# Altium project Base_Board.PrjPcb
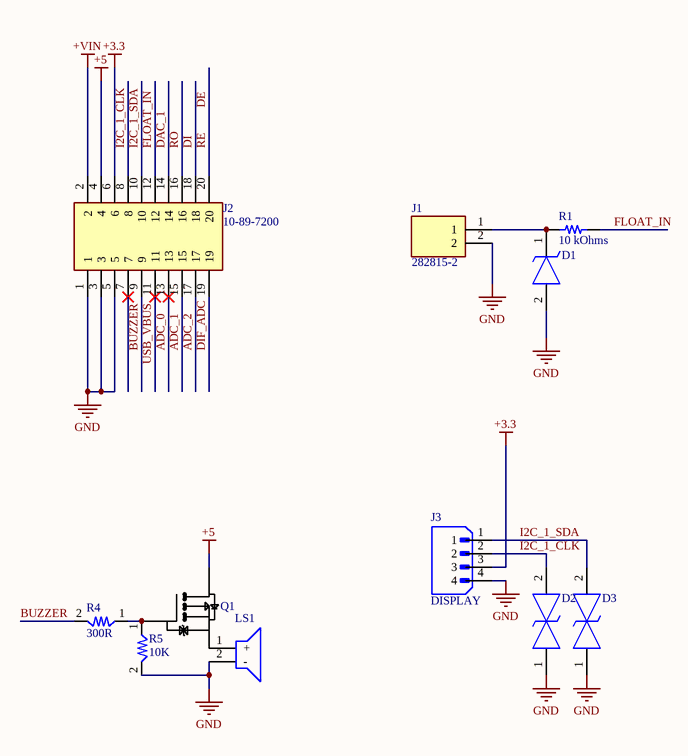
[diagram p0: Pinout.SchDoc]
5 sheets, 73 parts. Net scope: global (net labels, ports and power ports of the same name join across sheets).
Board file: PCB.PcbDoc
Sheets:
  Pinout.SchDoc
  PWR.SchDoc
  RS485.SchDoc
  ADC.SchDoc
  DAC_OUT.SchDoc

## Sheet Pinout.SchDoc
size A; SheetNumber: 1; SheetTotal: 5

### Parts
D1  SMBJ5.0A  [SMBJ12A]  (value not drawn)
D2  DESD3V3Z1BCSF-7  [DESD3V3Z1BCSF7]  (value not drawn)
D3  DESD3V3Z1BCSF-7  [DESD3V3Z1BCSF7]  (value not drawn)
J1  282815-2  [SHDRRA2W102P0X508_1X2_1016X1200X850P]
J2  10-89-7200  [HDRV20W87P254_2X10_2553X508X864P]
J3  DISPLAY  [JST_B4B-XH-A(LF)(SN)]
LS1  CMI-1295IC-0585T  [CMI1295IC0585T]  (value not drawn)
Q1  DMG3415U-7  [SOT96P240X110-3N]  (value not drawn)
R1  10 kOhms  [RES 0603_1608]
R4  300R  [RES0603]
R5  10K  [RES0603]

### Nets
+3.3: J2.6 J3.3
+5: J2.4 Q1.3(D)
+VIN: J2.2
GND: D1.2(A) D2.1 D3.1 J1.2 J2.1 J2.3 J2.5 J3.4 LS1.2(-) R5.2
ADC_0: J2.13
ADC_1: J2.15
ADC_2: J2.17
BUZZER: J2.9 R4.2
DAC_1: J2.14
DE: J2.20  [also labelled RE]
DI: J2.18
DIF_ADC: J2.19
FLOAT_IN: J2.12 R1.1
I2C_1_CLK: D2.2 J2.8 J3.2
I2C_1_SDA: D3.2 J2.10 J3.1
RO: J2.16
USB_VBUS: J2.11
NetD1_1: D1.1(K) J1.1 R1.2
NetLS1_1: LS1.1(+) Q1.2(S)
NetQ1_1: Q1.1(G) R4.1 R5.1

Not connected (* = marked no-connect by the designer): J2 7*

### Library data of the parts
D1 = SMBJ5.0A: TVS Diode (Uni-directional); Manufacturer_Name: STMicroelectronics; Datasheet Link: https://www.st.com/resource/en/datasheet/smbj12a.pdf; Height: 2.45mm; Manufacturer_Part_Number: SMBJ5.0A
D2 D3 = DESD3V3Z1BCSF-7: TVS Diode (Bi-directional); Manufacturer_Name: Diodes Incorporated; Datasheet Link: https://www.diodes.com/assets/Package-Files/X2-WLB0603-2.pdf; Height: 0.32mm; Manufacturer_Part_Number: DESD3V3Z1BCSF-7; Mouser Part Number: 621-DESD3V3Z1BCSF-7; Mouser Price/Stock: https://www.mouser.co.uk/ProductDetail/Diodes-Incorporated/DESD3V3Z1BCSF-7?qs=HXFqYaX1Q2xS5VnKZuyjmg%3D%3D; Arrow Part Number: DESD3V3Z1BCSF-7; Arrow Price/Stock: https://www.arrow.com/en/products/desd3v3z1bcsf-7/diodes-incorporated?utm_currency=USD&region=nac
J1 = 282815-2: Connector; Manufacturer_Name: TE Connectivity; Datasheet Link: https://www.te.com/commerce/DocumentDelivery/DDEController?Action=srchrtrv&DocNm=1-773958-1&DocType=Data%20Sheet&DocLang=English&PartCntxt=282815-2&DocFormat=pdf; Height: 8.5mm; Manufacturer_Part_Number: 282815-2; Mouser Part Number: 571-282815-2; Mouser Price/Stock: https://www.mouser.co.uk/ProductDetail/TE-Connectivity/282815-2?qs=79%2FjLZ2kXkpF7MFURi982A%3D%3D; Arrow Part Number: 282815-2; Arrow Price/Stock: https://www.arrow.com/en/products/282815-2/te-connectivity?region=nac
J2 = 10-89-7200: Connector; Manufacturer_Name: Molex; Datasheet Link: https://www.molex.com/content/dam/molex/molex-dot-com/products/automated/en-us/salesdrawingpdf/702/70280/010897200_sd.pdf?inline; Height: 8.64mm; Manufacturer_Part_Number: 10-89-7200; Mouser Part Number: 538-10-89-7200; Mouser Price/Stock: https://www.mouser.co.uk/ProductDetail/Molex/10-89-7200?qs=oWQp3ZoCHH25CPUgqQXm8A%3D%3D
J3 = B4B-XH-A(LF)(SN): Connector Header Through Hole 4 position 0.098 (2.50mm); MF: JST Sales; SnapEDA_Link: https://www.snapeda.com/parts/B4B-XH-A(LF)(SN)/JST+Sales+America+Inc./view-part/?ref=snap; Package: None; Value: *; MP: B4B-XH-A(LF)(SN); Check_prices: https://www.snapeda.com/parts/B4B-XH-A(LF)(SN)/JST+Sales+America+Inc./view-part/?ref=eda
LS1 = CMI-1295IC-0585T: Loudspeaker or Buzzer; Manufacturer_Name: Same Sky; Datasheet Link: https://www.sameskydevices.com/product/resource/CMI-1295IC-0585T.pdf; Height: 9.7mm; Manufacturer_Part_Number: CMI-1295IC-0585T; Mouser Part Number: 490-CMI-1295IC-0585T; Mouser Price/Stock: https://www.mouser.co.uk/ProductDetail/Same-Sky/CMI-1295IC-0585T?qs=OlC7AqGiEDkuskN%2Fok3iNw%3D%3D; Arrow Part Number: CMI-1295IC-0585T; Arrow Price/Stock: https://www.arrow.com/en/products/cmi-1295ic-0585t/cui-devices?utm_currency=USD&region=nac
Q1 = DMG3415U-7: Integrated Circuit; Manufacturer_Name: Lattice Semiconductor; Datasheet Link: https://media.digikey.com/pdf/Data%20Sheets/Diodes%20PDFs/DMG3415U.pdf; Height: 1.1mm; Manufacturer_Part_Number: DMG3415U-7; Mouser Part Number: N/A; Mouser Price/Stock: https://www.mouser.com/Search/Refine.aspx?Keyword=N%2FA
R1 = RT0603FRE0710KL: RES SMD 10K OHM 1% 1/10W 0603; Manufacturer: Yageo; Power (Watts): 0.1W, 1/10W; Temperature Coefficient: ±50ppm/°C; Part Number: RT0603FRE0710KL; Value: 10 kOhms; ComponentLink1Description: Datasheet; ComponentLink1URL: https://www.yageo.com/upload/media/product/productsearch/datasheet/rchip/PYu-RT_1-to-0.01_RoHS_L_11.pdf; ComponentLink2Description: DigiKey Link; ComponentLink2URL: https://www.digikey.com/en/products/detail/yageo/RT0603FRE0710KL/1075040; Composition: Thin Film; Device Package: 0603 (1608 Metric); Height - Seated (Max): 0.022" (0.55mm); LastUpdated: 9/19/2022 1:22:31 PM; Lifecycle Status: Active; Minimum Order: 1; Number of Terminations: 2; Operating Temperature: -55°C ~ 155°C; Package / Case: 0603 (1608 Metric); Packaging: TapeAndReel; PartId: 5671; Part Status: Active; Price: 0.01; Resistance: 10 kOhms; Series: RT; Size / Dimension: 0.063" L x 0.031" W (1.60mm x 0.80mm); Supplier 1: DigiKey; Supplier Part Number 1: YAG2321CT-ND; Supplier Device Package: 0603; Tolerance: ±1%
R4 R5 = RES: Resistor; Manufacturer_Name: UNI-ROYAL(Uniroyal Elec); Manufacturer_Part_Number: 0603WAF1001T5E; Datasheet Link: https://datasheet.lcsc.com/szlcsc/Uniroyal-Elec-0603WAF1001T5E_C21190.pdf; Height: 0.55mm

## Sheet PWR.SchDoc
size A; SheetNumber: 1; SheetTotal: 4
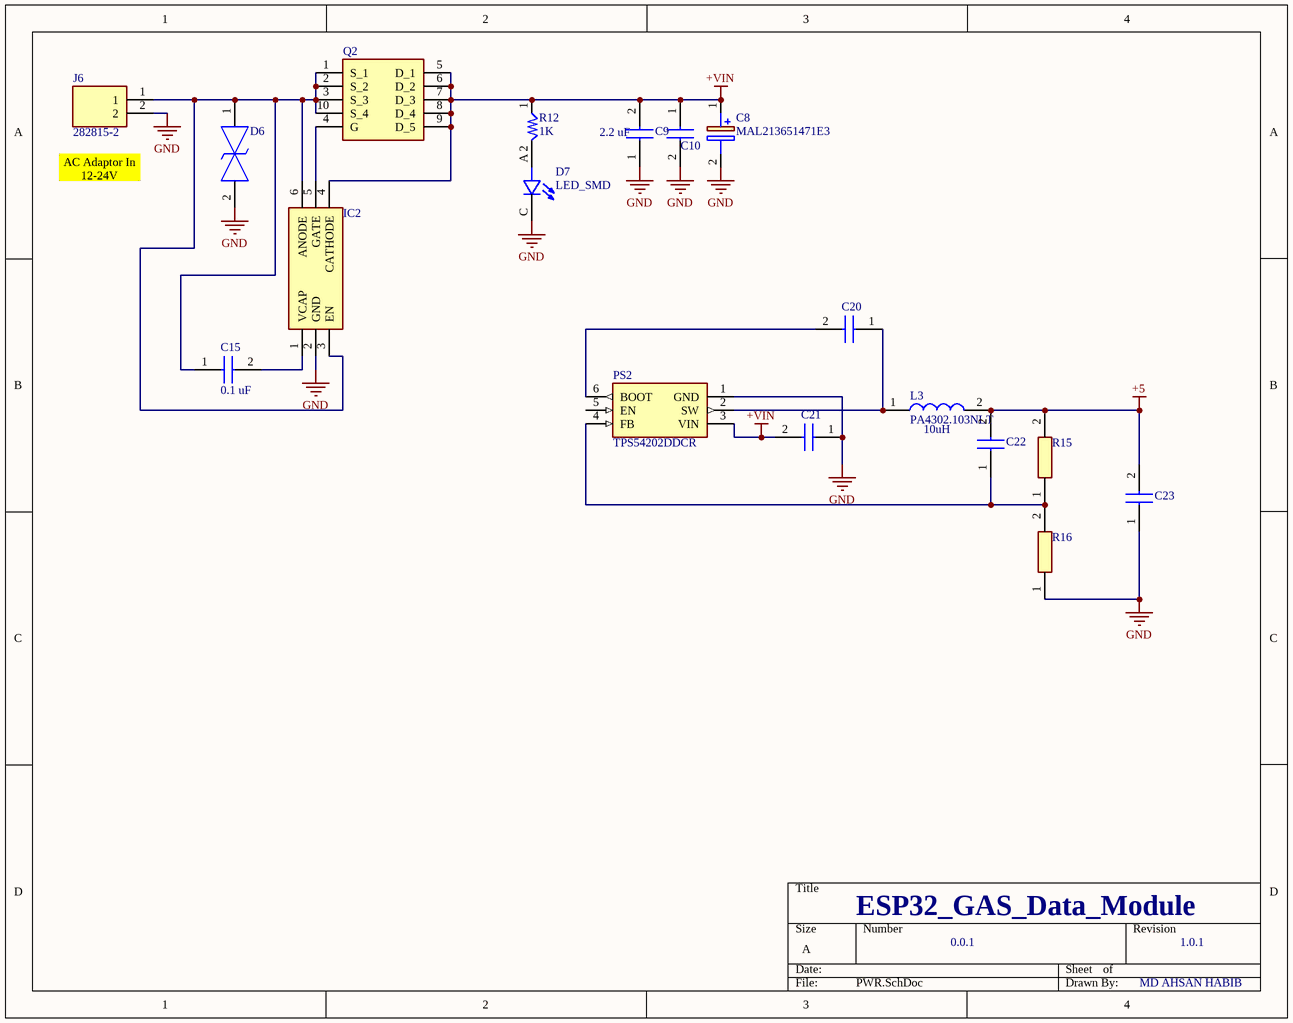
[diagram p1: PWR.SchDoc]

### Parts
C8  MAL213651471E3  [CAPPRD500W60D1300H2700]
C9  2.2 uF  [CAP0603]
C10  C5750X5R1H106K230KA  [C5750_Commercial]  (value not drawn)
C15  0.1 uF  [CAP0603]
C20  C0805C104M5RAC-TU  [CAPC2012X88N]  (value not drawn)
C21  C5750X5R1H106K230KA  [CAP0603]  (value not drawn)
C22  CGA1A2C0G1E820J030BA  [CAP0603]  (value not drawn)
C23  GRM32ER61C476KE15L  [CAPC3225X270N]  (value not drawn)
D6  SMBJ24CA-13-F  [DIONM5336X250N]  (value not drawn)
D7  LED_SMD  [LEDSC125X200X90-2N]
IC2  LM74700QDBVTQ1  [SOT95P280X145-6N]  (value not drawn)
J6  282815-2  [SHDRRA2W102P0X508_1X2_1016X1200X850P]
L3  PA4302.103NLT  [PA4302103NLT]
PS2  TPS54202DDCR  [SOT95P280X110-6N]
Q2  BSC014N06NSATMA1  [BSC010N04LS6ATMA1]  (value not drawn)
R12  1K  [RES0603]
R15  CRCW0402100KFKEDHP  [RES0603]  (value not drawn)
R16  CRCW040213K7FKEDHP  [RES0603]  (value not drawn)

### Nets
+5: C22.2 C23.2 L3.2 R15.2
+VIN: C8.1(+) C9.2 C10.1 C21.2 IC2.4(CATHODE) PS2.3(VIN) Q2.5(D_1) Q2.6(D_2) Q2.7(D_3) Q2.8(D_4) Q2.9(D_5) R12.1
GND: C8.2(-) C9.1 C10.2 C21.1 C23.1 D6.2 D7.C IC2.2(GND) J6.2 PS2.1(GND) R16.1
NetC15_1: C15.1 D6.1 IC2.3(EN) IC2.6(ANODE) J6.1 Q2.1(S_1) Q2.2(S_2) Q2.3(S_3) Q2.10(S_4)
NetC15_2: C15.2 IC2.1(VCAP)
NetC20_1: C20.1 L3.1 PS2.2(SW)
NetC20_2: C20.2 PS2.6(BOOT)
NetC22_1: C22.1 PS2.4(FB) R15.1 R16.2
NetD7_A: D7.A R12.2
NetIC2_5: IC2.5(GATE) Q2.4(G)

Not connected (* = marked no-connect by the designer): PS2 5(EN)

### Notes on the sheet
- (near J6) AC Adaptor In 12-24V
- (near L3) 10uH
- ESP32_GAS_Data_Module
- 0.0.1
- 1.0.1
- MD AHSAN HABIB

### Library data of the parts
C8 = MAL213651471E3: Capacitor Polarised; Manufacturer_Name: Vishay; Datasheet Link: https://www.mouser.co.uk/datasheet/2/427/136rvi-1762300.pdf; Height: 27mm; Manufacturer_Part_Number: MAL213651471E3; Mouser Part Number: 594-2222-136-51471; Mouser Price/Stock: https://www.mouser.co.uk/ProductDetail/Vishay-BC-Components/MAL213651471E3?qs=zGH8QOQ14qXx9%252BWDTpPwWA%3D%3D
C9 C15 = CC0603KRX7R9BB104: Capacitor; Manufacturer_Name: YAGEO; Datasheet Link: https://componentsearchengine.com/Datasheets/2/CC0603KRX7R9BB104.pdf; Height: 0.9mm; Manufacturer_Part_Number: CC0603KRX7R9BB104; Mouser Part Number: 603-CC603KRX7R9BB104; Mouser Price/Stock: https://www.mouser.co.uk/ProductDetail/YAGEO/CC0603KRX7R9BB104?qs=vTakOoo5QyLvVCYM2ge8LQ%3D%3D; Arrow Part Number: CC0603KRX7R9BB104; Arrow Price/Stock: https://www.arrow.com/en/products/cc0603krx7r9bb104/yageo?utm_currency=USD&region=europe
C10 C21 = C5750X5R1H106K230KA: Capacitor; Manufacturer_Name: TDK; Datasheet Link: https://product.tdk.com/system/files/dam/doc/product/capacitor/ceramic/mlcc/catalog/mlcc_commercial_general_en.pdf; Height: 2.5mm; Manufacturer_Part_Number: C5750X5R1H106K230KA; Mouser Part Number: 810-C5750X5R1H106K; Mouser Price/Stock: https://www.mouser.co.uk/ProductDetail/TDK/C5750X5R1H106K230KA?qs=NRhsANhppD8lVYAvl0MZ3g%3D%3D; Arrow Part Number: C5750X5R1H106K230KA; Arrow Price/Stock: https://www.arrow.com/en/products/c5750x5r1h106k230ka/tdk?region=nac
C20 = C0805C104M5RAC-TU: Capacitor; Manufacturer_Name: Yageo Group; Datasheet Link: https://connect.kemet.com:7667/gateway/IntelliData-ComponentDocumentation/1.0/download/specsheet/C0805C104M5RACTU; Height: 0.88mm; Manufacturer_Part_Number: C0805C104M5RAC-TU; Arrow Part Number: C0805C104M5RAC-TU; Arrow Price/Stock: https://www.arrow.com/en/products/c0805c104m5ractu/kemet-corporation?region=nac
C22 = CGA1A2C0G1E820J030BA: Capacitor; Manufacturer_Name: TDK; Datasheet Link: https://product.tdk.com/system/files/dam/doc/product/capacitor/ceramic/mlcc/catalog/mlcc_automotive_general_en.pdf; Height: 0.33mm; Manufacturer_Part_Number: CGA1A2C0G1E820J030BA
C23 = GRM32ER61C476KE15L: Capacitor; Manufacturer_Name: Murata Electronics; Datasheet Link: https://search.murata.co.jp/Ceramy/image/img/A01X/G101/ENG/GRM32ER61C476KE15-01A.pdf; Height: 2.7mm; Manufacturer_Part_Number: GRM32ER61C476KE15L; Mouser Part Number: 81-GRM32ER61C476KE5L; Mouser Price/Stock: https://www.mouser.co.uk/ProductDetail/Murata-Electronics/GRM32ER61C476KE15L?qs=%252B%2F7tQhzlcy7Im%2F1Gh2YSGQ%3D%3D; Arrow Part Number: GRM32ER61C476KE15L; Arrow Price/Stock: https://www.arrow.com/en/products/grm32er61c476ke15l/murata-manufacturing?utm_currency=USD&region=europe
D6 = SMBJ24CA-13-F: TVS Diode (Bi-directional); Manufacturer_Name: Diodes Incorporated; Datasheet Link: https://www.diodes.com/assets/Datasheets/ds19002.pdf; Height: 2.5mm; Manufacturer_Part_Number: SMBJ24CA-13-F; Mouser Part Number: 621-SMBJ24CA-13-F; Mouser Price/Stock: https://www.mouser.co.uk/ProductDetail/Diodes-Incorporated/SMBJ24CA-13-F?qs=gaDBXWSqsDCkhBi9r6ReOQ%3D%3D; Arrow Part Number: SMBJ24CA-13-F; Arrow Price/Stock: https://www.arrow.com/en/products/smbj24ca-13-f/diodes-incorporated?utm_currency=USD&region=nac
D7 = 5990110007F: Red 633nm LED Indication - Discrete 2.1V 0805 (2012 Metric); MF: Dialight; MP: 599-0110-007F; Check_prices: https://www.snapeda.com/parts/599-0110-007F/Dialight/view-part/?ref=eda; Value: *; Purchase-URL: https://pricing.snapeda.com/search/part/599-0110-007F/?ref=eda; Price: None; SnapEDA_Link: https://www.snapeda.com/parts/599-0110-007F/Dialight/view-part/?ref=snap; Availability: In Stock; Package: 0805 Dialight
IC2 = LM74700-Q1MKX-1_NOPB: Integrated Circuit; Manufacturer_Name: Texas Instruments; Manufacturer_Part_Number: LM74700-Q1MKX-1/NOPB; Datasheet Link: http://www.ti.com/lit/ds/symlink/lm74700-q1.pdf; Height: 1.45mm
J6 = 282815-2: as J1 on sheet Pinout; Datasheet Link: https://www.te.com/commerce/DocumentDelivery/DDEController?Action=srchrtrv&DocNm=1-773958-1&DocType=Data%20Sheet&DocLang=English&PartCntxt=282815-2&DocFormat=pdf; Height: 8.5mm; Manufacturer_Part_Number: 282815-2; Mouser Part Number: 571-282815-2; Mouser Price/Stock: https://www.mouser.co.uk/ProductDetail/TE-Connectivity/282815-2?qs=79%2FjLZ2kXkpF7MFURi982A%3D%3D; Arrow Part Number: 282815-2; Arrow Price/Stock: https://www.arrow.com/en/products/282815-2/te-connectivity?region=nac
L3 = PA4302.103NLT: Inductor; Manufacturer_Name: Yageo Group; Datasheet Link: https://www.mouser.com/datasheet/2/336/-559356.pdf; Height: 5.6mm; Manufacturer_Part_Number: PA4302.103NLT; Mouser Part Number: 673-PA4302.103NLT; Mouser Price/Stock: https://www.mouser.co.uk/ProductDetail/Pulse-Electronics/PA4302.103NLT?qs=ZU1dyKYMvyPXoPwo6qMOJg%3D%3D; Arrow Part Number: PA4302.103NLT; Arrow Price/Stock: https://www.arrow.com/en/products/pa4302.103nlt/pulse-electronics-corporation?region=nac
PS2 = TPS54202DDCR: Power Supply; Manufacturer_Name: Texas Instruments; Datasheet Link: http://www.ti.com/lit/gpn/tps54202; Height: 1.1mm; Manufacturer_Part_Number: TPS54202DDCR; Mouser Part Number: 595-TPS54202DDCR; Mouser Price/Stock: https://www.mouser.co.uk/ProductDetail/Texas-Instruments/TPS54202DDCR?qs=uP22XH7NdCsJtN%2Fq54jCtQ%3D%3D; Arrow Part Number: TPS54202DDCR; Arrow Price/Stock: https://www.arrow.com/en/products/tps54202ddcr/texas-instruments?utm_currency=USD&region=nac
Q2 = BSC014N06NSATMA1: MOSFET (N-Channel); Manufacturer_Name: Infineon; Datasheet Link: http://www.farnell.com/datasheets/1849651.html; Height: 1.1mm; Manufacturer_Part_Number: BSC014N06NSATMA1; Mouser Part Number: 726-BSC014N06NSATMA1; Mouser Price/Stock: https://www.mouser.co.uk/ProductDetail/Infineon-Technologies/BSC014N06NSATMA1?qs=K00xGehIljshgUA78G26tg%3D%3D; Arrow Part Number: BSC014N06NSATMA1; Arrow Price/Stock: https://www.arrow.com/en/products/bsc014n06nsatma1/infineon-technologies-ag?region=nac
R12 = RES: as R4 on sheet Pinout; Datasheet Link: https://datasheet.lcsc.com/szlcsc/Uniroyal-Elec-0603WAF1001T5E_C21190.pdf; Height: 0.55mm
R15 = CRCW0402100KFKEDHP: Resistor; Manufacturer_Name: Vishay; Datasheet Link: http://www.vishay.com/docs/20035/dcrcwe3.pdf; Height: 0.4mm; Manufacturer_Part_Number: CRCW0402100KFKEDHP; Mouser Part Number: 71-CRCW0402100KFKEDH; Mouser Price/Stock: https://www.mouser.co.uk/ProductDetail/Vishay-Dale/CRCW0402100KFKEDHP?qs=k2%2FDWSARqgGFakjlJe4Ejw%3D%3D; Arrow Part Number: CRCW0402100KFKEDHP; Arrow Price/Stock: https://www.arrow.com/en/products/crcw0402100kfkedhp/vishay?utm_currency=USD&region=nac
R16 = CRCW040213K7FKEDHP: Resistor; Manufacturer_Name: Vishay; Datasheet Link: http://www.vishay.com/docs/20035/dcrcwe3.pdf; Height: 0.4mm; Manufacturer_Part_Number: CRCW040213K7FKEDHP; Mouser Part Number: N/A; Mouser Price/Stock: https://www.mouser.co.uk/ProductDetail/Vishay-Dale/CRCW040213K7FKEDHP?qs=VAB4DzKv5wWcbGmoe9QIoA%3D%3D; Arrow Part Number: CRCW040213K7FKEDHP; Arrow Price/Stock: https://www.arrow.com/en/products/crcw040213k7fkedhp/vishay?region=nac

## Sheet RS485.SchDoc
size A; SheetNumber: 3; SheetTotal: 4
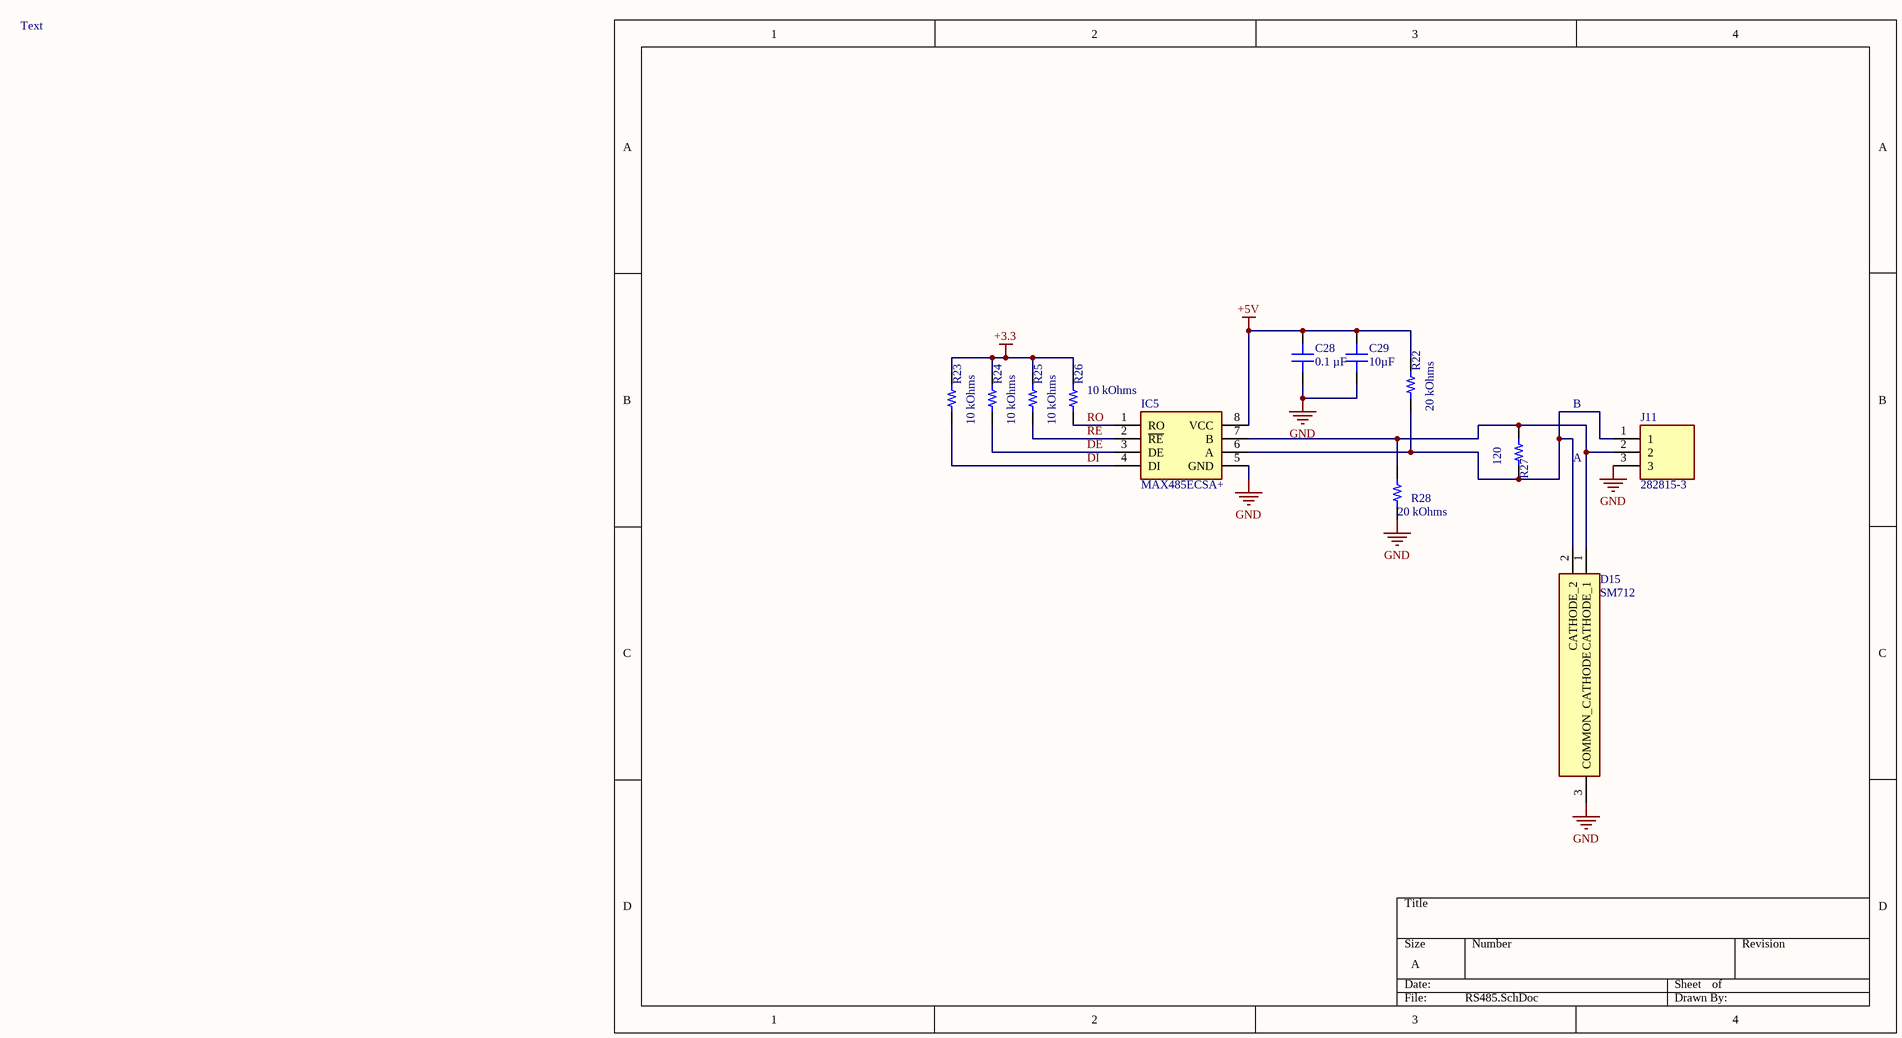
[diagram p2: RS485.SchDoc]

### Parts
C28  0.1 µF  [CAP 0603_1608]
C29  10µF  [CAP 1206_3216 - 1.8MM]
D15  SM712  [SOT95P240X115-3N]
IC5  MAX485ECSA+  [SOIC127P600X175-8N]
J11  282815-3  [2828153]
R22  20 kOhms  [RES 0603_1608]
R23  10 kOhms  [RES 0603_1608]
R24  10 kOhms  [RES 0603_1608]
R25  10 kOhms  [RES 0603_1608]
R26  10 kOhms  [RES 0603_1608]
R27  120  [RES 0603_1608]
R28  20 kOhms  [RES 0603_1608]

### Nets
+3.3: R23.2 R24.2 R25.2 R26.2
+5V: C28.2 C29.2 IC5.8(VCC) R22.2
GND: C28.1 C29.1 D15.3(COMMON_CATHODE) IC5.5(GND) J11.3 R28.1
DE: IC5.2(~{RE}) IC5.3(DE) R24.1 R25.1  [also labelled RE]
DI: IC5.4(DI) R23.1
RO: IC5.1(RO) R26.1
NetD15_1: D15.1(CATHODE_1) IC5.7(B) J11.2 R27.2 R28.2
NetD15_2: D15.2(CATHODE_2) IC5.6(A) J11.1 R22.1 R27.1

### Notes on the sheet
- Text
- B
- A

### Library data of the parts
C28 = C0603C104K5RAC7411: CAP CER 0.1UF 50V X7R 0603; manufacturer: KEMET; Tolerance: ±10%; Part Number: C0603C104K5RAC7411; Value: 0.1 µF; Applications: Bypass, Decoupling; Capacitance: 0.1 µF; componentlink1description: Datasheet; componentlink1url: https://api.kemet.com/component-edge/download/datasheet/C0603C104K5RAC7411.pdf; componentlink2description: DigiKey Link; componentlink2url: https://www.digikey.com/en/products/detail/kemet/C0603C104K5RAC7411/3317013; Device Package: 0603 (1608 Metric); lastupdated: 9/19/2022 1:01:20 PM; Lifecycle Status: Active; Minimum Order: 15000; Mounting Type: Surface Mount, MLCC; Operating Temperature: -55°C ~ 125°C; Package / Case: 0603 (1608 Metric); packaging: TapeAndReel; partid: 2233; Part Status: Active; price: 0.01; series: SMD Comm X7R; Size / Dimension: 0.063" L x 0.031" W (1.60mm x 0.80mm); Supplier 1: DigiKey; Supplier Part Number 1: 399-7374-2-ND; Temperature Coefficient: X7R; Thickness (Max): 0.035" (0.90mm); Voltage - Rated: 50V
C29 = 12065D106KAT2A: CAP CER 10UF 50V X5R 1206; manufacturer: AVX Corporation; Tolerance: ±10%; Part Number: 12065D106KAT2A; Value: 10µF; Applications: General Purpose; Capacitance: 10µF; componentlink1description: Datasheet; componentlink1url: http://datasheets.avx.com/cx5r.pdf; componentlink2description: DigiKey Link; componentlink2url: http://digikey.com/product-detail/en/avx-corporation/12065D106KAT2A/478-9979-1-ND/6149060; Device Package: 1206 (3216 Metric); lastupdated: 9/2/2020 1:05:35 AM; Lifecycle Status: Active; Minimum Order: 1; Mounting Type: Surface Mount, MLCC; Operating Temperature: -55°C ~ 85°C; Package / Case: 1206 (3216 Metric); packaging: TapeAndReel; partid: 21345; Part Status: Active; price: 0.16; series: -; Size / Dimension: 0.126" L x 0.063" W (3.20mm x 1.60mm); Supplier 1: DigiKey; Supplier Part Number 1: 478-9979-1-ND; Temperature Coefficient: X5R; Thickness (Max): 0.071" (1.80mm); Voltage - Rated: 50V
D15 = SM712: TVS Diode (Bi-directional); Manufacturer_Name: DOWO; Datasheet Link: https://datasheet.lcsc.com/szlcsc/DOWO-SM712_C293966.pdf; Height: 1.15mm; Manufacturer_Part_Number: SM712
IC5 = MAX485ECSA+: Integrated Circuit; Manufacturer_Name: Analog Devices; Datasheet Link: http://datasheets.maximintegrated.com/en/ds/MAX1487E-MAX491E.pdf; Height: 1.75mm; Manufacturer_Part_Number: MAX485ECSA+; Mouser Part Number: 700-MAX485ECSA; Mouser Price/Stock: https://www.mouser.co.uk/ProductDetail/Analog-Devices-Maxim-Integrated/MAX485ECSA%2b?qs=1THa7WoU59Gy3FCdT5o1Tg%3D%3D; Arrow Part Number: MAX485ECSA+; Arrow Price/Stock: https://www.arrow.com/en/products/max485ecsa/analog-devices?utm_currency=USD&region=nac
J11 = 282815-3: Connector; Manufacturer_Name: TE Connectivity; Datasheet Link: https://www.te.com/commerce/DocumentDelivery/DDEController?Action=srchrtrv&DocNm=1-773958-1&DocType=Data%20Sheet&DocLang=English&PartCntxt=282815-3&DocFormat=pdf; Height: 8.35mm; Manufacturer_Part_Number: 282815-3; Mouser Part Number: 571-282815-3; Mouser Price/Stock: https://www.mouser.co.uk/ProductDetail/TE-Connectivity/282815-3?qs=79%2FjLZ2kXkqd6grVMiPYfw%3D%3D; Arrow Part Number: 282815-3; Arrow Price/Stock: https://www.arrow.com/en/products/282815-3/te-connectivity
R22 R27 R28 = RT0603FRE0710KL: RES SMD 10K OHM 1% 1/10W 0603; Manufacturer: Yageo; Power (Watts): 0.1W, 1/10W; Resistance: 10 kOhms; Temperature Coefficient: ±50ppm/°C; Part Number: RT0603FRE0710KL; ComponentLink1Description: Datasheet; ComponentLink1URL: https://www.yageo.com/upload/media/product/productsearch/datasheet/rchip/PYu-RT_1-to-0.01_RoHS_L_11.pdf; ComponentLink2Description: DigiKey Link; ComponentLink2URL: https://www.digikey.com/en/products/detail/yageo/RT0603FRE0710KL/1075040; Composition: Thin Film; Device Package: 0603 (1608 Metric); Height - Seated (Max): 0.022" (0.55mm); LastUpdated: 9/19/2022 1:22:31 PM; Lifecycle Status: Active; Minimum Order: 1; Number of Terminations: 2; Operating Temperature: -55°C ~ 155°C; Package / Case: 0603 (1608 Metric); Packaging: TapeAndReel; PartId: 5671; Part Status: Active; Price: 0.01; Series: RT; Size / Dimension: 0.063" L x 0.031" W (1.60mm x 0.80mm); Supplier 1: DigiKey; Supplier Part Number 1: YAG2321CT-ND; Supplier Device Package: 0603; Tolerance: ±1%
  R22 R28: Value: 20 kOhms
  R27: Value: 120
R23-R26 = RT0603FRE0710KL: as R1 on sheet Pinout; Part Number: RT0603FRE0710KL; Value: 10 kOhms; ComponentLink1Description: Datasheet; ComponentLink1URL: https://www.yageo.com/upload/media/product/productsearch/datasheet/rchip/PYu-RT_1-to-0.01_RoHS_L_11.pdf; ComponentLink2Description: DigiKey Link; ComponentLink2URL: https://www.digikey.com/en/products/detail/yageo/RT0603FRE0710KL/1075040; Composition: Thin Film; Device Package: 0603 (1608 Metric); Height - Seated (Max): 0.022" (0.55mm); LastUpdated: 9/19/2022 1:22:31 PM; Lifecycle Status: Active; Minimum Order: 1; Number of Terminations: 2; Operating Temperature: -55°C ~ 155°C; Package / Case: 0603 (1608 Metric); Packaging: TapeAndReel; PartId: 5671; Part Status: Active; Price: 0.01; Resistance: 10 kOhms; Series: RT; Size / Dimension: 0.063" L x 0.031" W (1.60mm x 0.80mm); Supplier 1: DigiKey; Supplier Part Number 1: YAG2321CT-ND; Supplier Device Package: 0603; Tolerance: ±1%

## Sheet ADC.SchDoc
size A; SheetNumber: 4; SheetTotal: 4
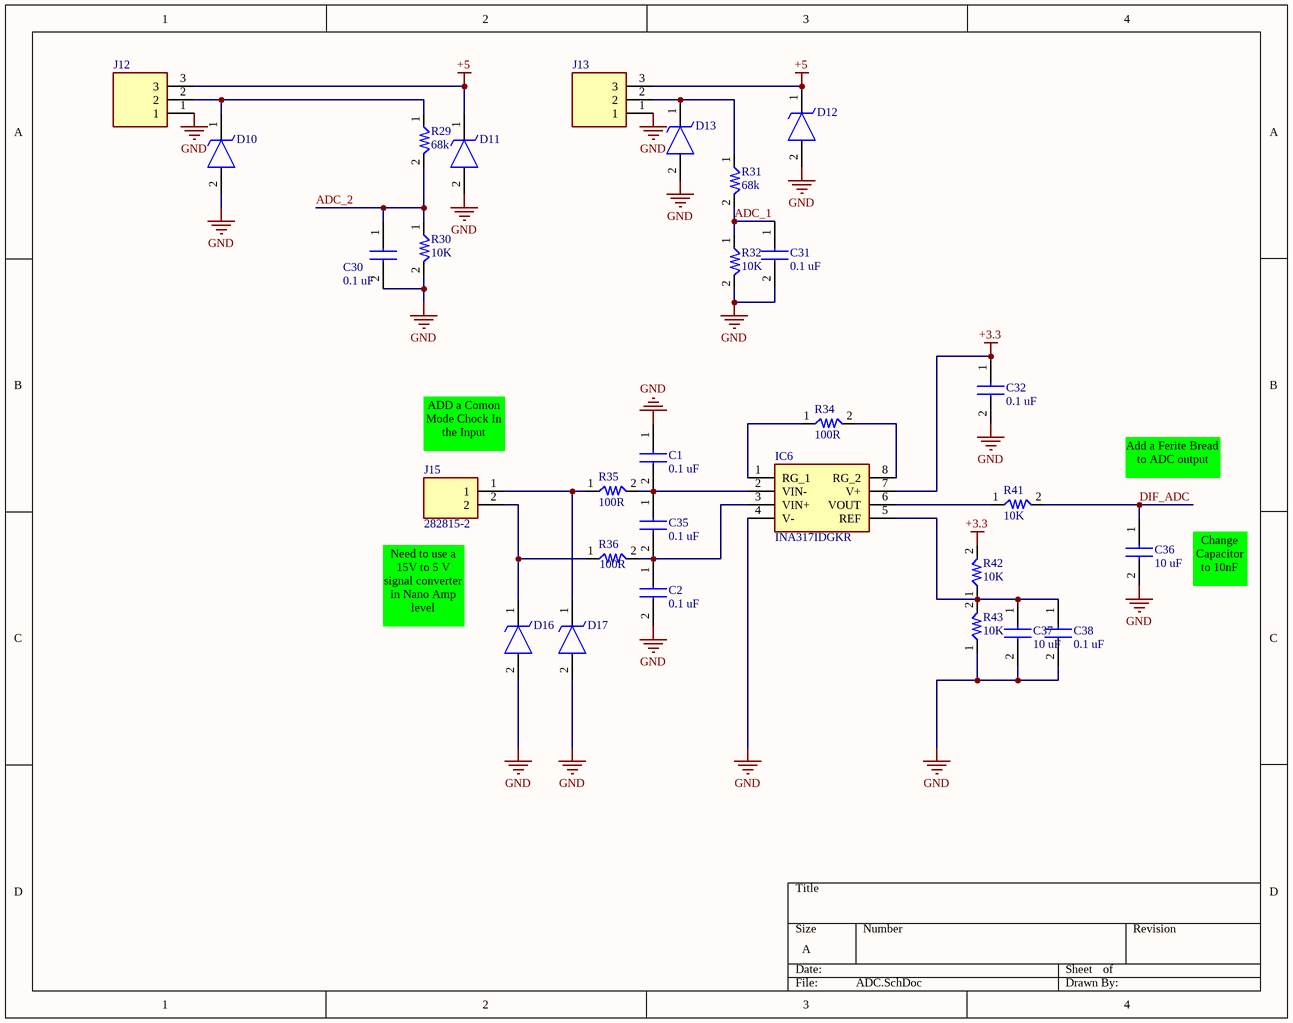
[diagram p3: ADC.SchDoc]

### Parts
C1  0.1 uF  [CAP0603]
C2  0.1 uF  [CAP0603]
C30  0.1 uF  [CAP0603]
C31  0.1 uF  [CAP0603]
C32  0.1 uF  [CAP0603]
C35  0.1 uF  [CAP0603]
C36  10 uF  [CAP0603]
C37  10 uF  [CAP0603]
C38  0.1 uF  [CAP0603]
D10  SMBJ5.0A  [SMBJ12A]  (value not drawn)
D11  SMBJ5.0A  [SMBJ12A]  (value not drawn)
D12  SMBJ5.0A  [SMBJ12A]  (value not drawn)
D13  SMBJ5.0A  [SMBJ12A]  (value not drawn)
D16  SMBJ5.0A  [SMBJ12A]  (value not drawn)
D17  SMBJ5.0A  [SMBJ12A]  (value not drawn)
IC6  INA317IDGKR  [SOP65P490X110-8N]
J12  282815-3  [2828153]  (value not drawn)
J13  282815-3  [2828153]  (value not drawn)
J15  282815-2  [SHDRRA2W102P0X508_1X2_1016X1200X850P]
R29  68k  [RES0603]
R30  10K  [RES0603]
R31  68k  [RES0603]
R32  10K  [RES0603]
R34  100R  [RES0603]
R35  100R  [RES0603]
R36  100R  [RES0603]
R41  10K  [RES0603]
R42  10K  [RES0603]
R43  10K  [RES0603]

### Nets
+3.3: C32.1 IC6.7(V+) R42.2
+5: D11.1(K) D12.1(K) J12.3 J13.3
GND: C1.1 C2.2 C30.2 C31.2 C32.2 C36.2 C37.2 C38.2 D10.2(A) D11.2(A) D12.2(A) D13.2(A) D16.2(A) D17.2(A) IC6.4(V-) J12.1 J13.1 R30.2 R32.2 R43.1
ADC_1: C31.1 R31.2 R32.1
ADC_2: C30.1 R29.2 R30.1
DIF_ADC: C36.1 R41.2
NetC1_2: C1.2 C35.1 IC6.2(VIN-) R35.2
NetC2_1: C2.1 C35.2 IC6.3(VIN+) R36.2
NetC37_1: C37.1 C38.1 IC6.5(REF) R42.1 R43.2
NetD10_1: D10.1(K) J12.2 R29.1
NetD13_1: D13.1(K) J13.2 R31.1
NetD16_1: D16.1(K) J15.2 R36.1
NetD17_1: D17.1(K) J15.1 R35.1
NetIC6_1: IC6.1(RG_1) R34.1
NetIC6_6: IC6.6(VOUT) R41.1
NetIC6_8: IC6.8(RG_2) R34.2

### Notes on the sheet
- (near J15) ADD a Comon Mode Chock In the Input
- Add a Ferite Bread to ADC output
- Need to use a 15V to 5 V signal converter in Nano Amp level
- Change Capacitor to 10nF

### Library data of the parts
C1 C2 C30-C32 C35-C38 = CC0603KRX7R9BB104: Capacitor; Manufacturer_Name: YAGEO; Datasheet Link: https://componentsearchengine.com/Datasheets/2/CC0603KRX7R9BB104.pdf; Height: 0.9mm; Manufacturer_Part_Number: CC0603KRX7R9BB104; Mouser Part Number: 603-CC603KRX7R9BB104; Mouser Price/Stock: https://www.mouser.co.uk/ProductDetail/YAGEO/CC0603KRX7R9BB104?qs=vTakOoo5QyLvVCYM2ge8LQ%3D%3D; Arrow Part Number: CC0603KRX7R9BB104; Arrow Price/Stock: https://www.arrow.com/en/products/cc0603krx7r9bb104/yageo?utm_currency=USD&region=europe
D10-D13 D16 D17 = SMBJ5.0A: as D1 on sheet Pinout; Datasheet Link: https://www.st.com/resource/en/datasheet/smbj12a.pdf; Height: 2.45mm; Manufacturer_Part_Number: SMBJ5.0A
IC6 = INA317IDGKR: Integrated Circuit; Manufacturer_Name: Texas Instruments; Datasheet Link: http://www.ti.com/lit/gpn/ina317; Height: 1.1mm; Manufacturer_Part_Number: INA317IDGKR; Mouser Part Number: 595-INA317IDGKR; Mouser Price/Stock: https://www.mouser.co.uk/ProductDetail/Texas-Instruments/INA317IDGKR?qs=W0yvOO0ixfHq371pIwwl1g%3D%3D; Arrow Part Number: INA317IDGKR; Arrow Price/Stock: https://www.arrow.com/en/products/ina317idgkr/texas-instruments?utm_currency=USD&region=nac
J12 J13 = 282815-3: as J11 on sheet RS485; Datasheet Link: https://www.te.com/commerce/DocumentDelivery/DDEController?Action=srchrtrv&DocNm=1-773958-1&DocType=Data%20Sheet&DocLang=English&PartCntxt=282815-3&DocFormat=pdf; Height: 8.35mm; Manufacturer_Part_Number: 282815-3; Mouser Part Number: 571-282815-3; Mouser Price/Stock: https://www.mouser.co.uk/ProductDetail/TE-Connectivity/282815-3?qs=79%2FjLZ2kXkqd6grVMiPYfw%3D%3D; Arrow Part Number: 282815-3; Arrow Price/Stock: https://www.arrow.com/en/products/282815-3/te-connectivity
J15 = 282815-2: as J1 on sheet Pinout; Datasheet Link: https://www.te.com/commerce/DocumentDelivery/DDEController?Action=srchrtrv&DocNm=1-773958-1&DocType=Data%20Sheet&DocLang=English&PartCntxt=282815-2&DocFormat=pdf; Height: 8.5mm; Manufacturer_Part_Number: 282815-2; Mouser Part Number: 571-282815-2; Mouser Price/Stock: https://www.mouser.co.uk/ProductDetail/TE-Connectivity/282815-2?qs=79%2FjLZ2kXkpF7MFURi982A%3D%3D; Arrow Part Number: 282815-2; Arrow Price/Stock: https://www.arrow.com/en/products/282815-2/te-connectivity?region=nac
R29-R32 R34-R36 R41-R43 = RES: as R4 on sheet Pinout; Datasheet Link: https://datasheet.lcsc.com/szlcsc/Uniroyal-Elec-0603WAF1001T5E_C21190.pdf; Height: 0.55mm

## Sheet DAC_OUT.SchDoc
size A; SheetNumber: 5; SheetTotal: 5
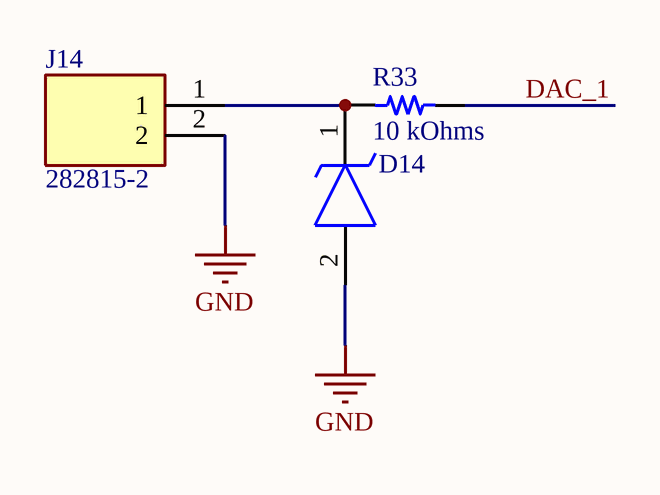
[diagram p4: DAC_OUT.SchDoc]

### Parts
D14  SMBJ5.0A  [SMBJ12A]  (value not drawn)
J14  282815-2  [SHDRRA2W102P0X508_1X2_1016X1200X850P]
R33  10 kOhms  [RES 0603_1608]

### Nets
GND: D14.2(A) J14.2
DAC_1: R33.1
NetD14_1: D14.1(K) J14.1 R33.2

### Library data of the parts
D14 = SMBJ5.0A: as D1 on sheet Pinout; Datasheet Link: https://www.st.com/resource/en/datasheet/smbj12a.pdf; Height: 2.45mm; Manufacturer_Part_Number: SMBJ5.0A
J14 = 282815-2: as J1 on sheet Pinout; Datasheet Link: https://www.te.com/commerce/DocumentDelivery/DDEController?Action=srchrtrv&DocNm=1-773958-1&DocType=Data%20Sheet&DocLang=English&PartCntxt=282815-2&DocFormat=pdf; Height: 8.5mm; Manufacturer_Part_Number: 282815-2; Mouser Part Number: 571-282815-2; Mouser Price/Stock: https://www.mouser.co.uk/ProductDetail/TE-Connectivity/282815-2?qs=79%2FjLZ2kXkpF7MFURi982A%3D%3D; Arrow Part Number: 282815-2; Arrow Price/Stock: https://www.arrow.com/en/products/282815-2/te-connectivity?region=nac
R33 = RT0603FRE0710KL: as R1 on sheet Pinout; Part Number: RT0603FRE0710KL; Value: 10 kOhms; ComponentLink1Description: Datasheet; ComponentLink1URL: https://www.yageo.com/upload/media/product/productsearch/datasheet/rchip/PYu-RT_1-to-0.01_RoHS_L_11.pdf; ComponentLink2Description: DigiKey Link; ComponentLink2URL: https://www.digikey.com/en/products/detail/yageo/RT0603FRE0710KL/1075040; Composition: Thin Film; Device Package: 0603 (1608 Metric); Height - Seated (Max): 0.022" (0.55mm); LastUpdated: 9/19/2022 1:22:31 PM; Lifecycle Status: Active; Minimum Order: 1; Number of Terminations: 2; Operating Temperature: -55°C ~ 155°C; Package / Case: 0603 (1608 Metric); Packaging: TapeAndReel; PartId: 5671; Part Status: Active; Price: 0.01; Resistance: 10 kOhms; Series: RT; Size / Dimension: 0.063" L x 0.031" W (1.60mm x 0.80mm); Supplier 1: DigiKey; Supplier Part Number 1: YAG2321CT-ND; Supplier Device Package: 0603; Tolerance: ±1%

## Nets that join several sheets
+3.3: Pinout (J2.6 J3.3), RS485 (R23.2 R24.2 R25.2 R26.2), ADC (C32.1 IC6.7 R42.2)
+5: Pinout (J2.4 Q1.3), PWR (C22.2 C23.2 L3.2 R15.2), ADC (D11.1 D12.1 J12.3 J13.3)
+VIN: Pinout (J2.2), PWR (12 pins)
GND: Pinout (10 pins), PWR (11 pins), RS485 (6 pins), ADC (20 pins), DAC_OUT (D14.2 J14.2)
ADC_1: Pinout (J2.15), ADC (C31.1 R31.2 R32.1)
ADC_2: Pinout (J2.17), ADC (C30.1 R29.2 R30.1)
DAC_1: Pinout (J2.14), DAC_OUT (R33.1)
DE: Pinout (J2.20), RS485 (IC5.2 IC5.3 R24.1 R25.1)
DI: Pinout (J2.18), RS485 (IC5.4 R23.1)
DIF_ADC: Pinout (J2.19), ADC (C36.1 R41.2)
RO: Pinout (J2.16), RS485 (IC5.1 R26.1)